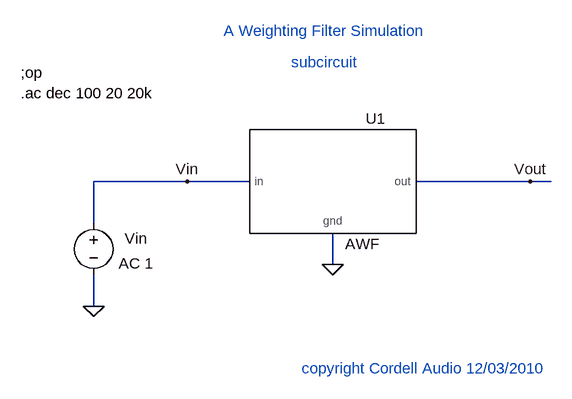
[diagram p0: schematic A Filter Subcircuit.asc]
A Filter Subcircuit.asc, the LTspice schematic file:
Version 4
SHEET 1 1692 1236
WIRE 64 480 -80 480
WIRE 160 480 64 480
WIRE 592 480 416 480
WIRE 624 480 592 480
WIRE -80 544 -80 480
WIRE 288 608 288 560
WIRE -80 672 -80 624
FLAG -80 672 0
FLAG 592 480 Vout
FLAG 64 480 Vin
FLAG 288 608 0
SYMBOL voltage -80 528 R0
WINDOW 3 -181 172 Left 0
WINDOW 123 39 78 Left 0
WINDOW 39 0 0 Left 0
WINDOW 0 48 40 Left 0
SYMATTR Value ""
SYMATTR Value2 AC 1
SYMATTR InstName Vin
SYMBOL AWF 288 480 R0
SYMATTR InstName U1
TEXT -192 312 Left 0 !;op
TEXT -192 344 Left 0 !.ac dec 100 20 20k
TEXT 120 248 Left 0 ;A Weighting Filter Simulation
TEXT 240 768 Left 0 ;copyright Cordell Audio 12/03/2010
TEXT 224 296 Left 0 ;subcircuit

The netlist it stands for:
* A Filter Subcircuit.asc
Vin Vin 0 AC 1
XU1 Vin Vout 0 AWF  ; pins in out gnd
;op
.ac dec 100 20 20k
* A Weighting Filter Simulation
* copyright Cordell Audio 12/03/2010
* subcircuit
.lib AWF.sub
.backanno
.end